# EAGLE schematic Comms_Cape (EAGLE 7.7.0)
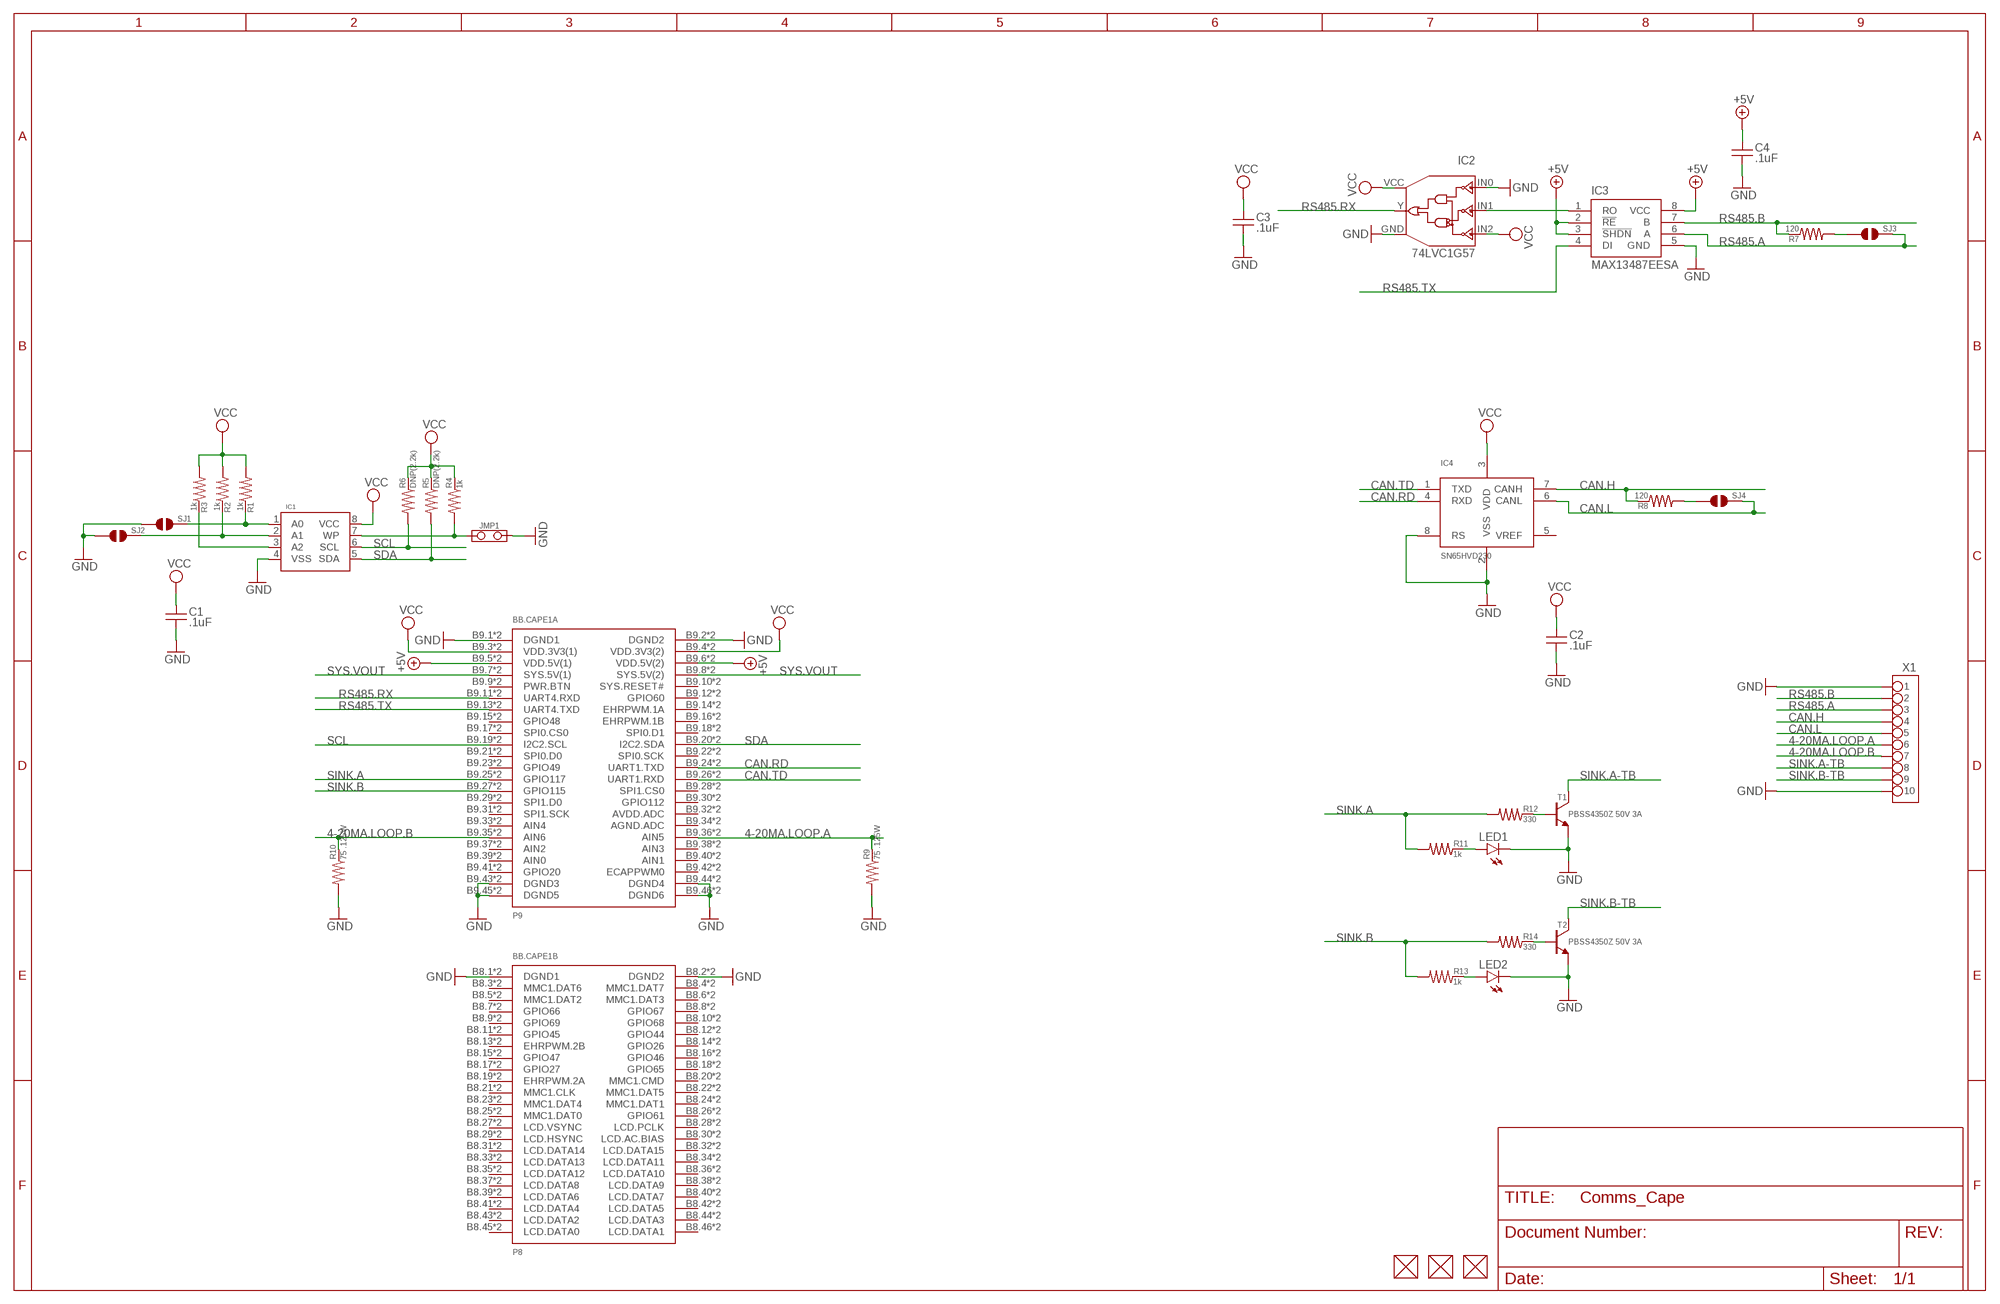
[diagram p0: schematic, sheet 1]

## Parts
BB.CAPE1  BEAGLEBONE.CAPE.TOP/BOTTOM-PADS  [BEAGLEBONE.CAPE.TOP/BOTTOM-PADS]
C1  .1uF  CAPACITOR-(INCH)-0402  [0402]
C2  .1uF  CAPACITOR-(INCH)-0402  [0402]
C3  .1uF  CAPACITOR-(INCH)-0402  [0402]
C4  .1uF  CAPACITOR-(INCH)-0402  [0402]
FUD1  FIDUCIAL  [FIDUCIAL_40MIL]
FUD2  FIDUCIAL  [FIDUCIAL_40MIL]
FUD3  FIDUCIAL  [FIDUCIAL_40MIL]
IC1  CAT24C32  [UDFN8,2X3(ON-SEMI)]
IC2  74LVC1G57  1G57-SOT-23-6  [SOT-23-6]
IC3  MAX13487EESA  [SOIC8]
IC4  SN65HVD230  MCP2551  [SO8]
JMP1  JUMPER-(X2)  [JUMPER-(X2)]
LED1  LED-(INCH)-0805  [0805-LED]
LED2  LED-(INCH)-0805  [0805-LED]
R1  1k  RESISTOR-(INCH)-0402  [0402]
R2  1k  RESISTOR-(INCH)-0402  [0402]
R3  1k  RESISTOR-(INCH)-0402  [0402]
R4  1k  RESISTOR-(INCH)-0402  [0402]
R5  DNP(2.2k)  RESISTOR-(INCH)-0402  [0402]
R6  DNP(2.2k)  RESISTOR-(INCH)-0402  [0402]
R7  120  RESISTOR-(INCH)-0402  [0402]
R8  120  RESISTOR-(INCH)-0402  [0402]
R9  75 .125W  RESISTOR-(INCH)-0805  [0805]
R10  75 .125W  RESISTOR-(INCH)-0805  [0805]
R11  1k  RESISTOR-(INCH)-0402  [0402]
R12  330  RESISTOR-(INCH)-0402  [0402]
R13  1k  RESISTOR-(INCH)-0402  [0402]
R14  330  RESISTOR-(INCH)-0402  [0402]
SJ1  SOLDER.JOINT-(INCH)-0402  [SOLDER.JOINT(0402)]
SJ2  SOLDER.JOINT-(INCH)-0402  [SOLDER.JOINT(0402)]
SJ3  SOLDER.JOINT-(INCH)-0402  [SOLDER.JOINT(0402)]
SJ4  SOLDER.JOINT-(INCH)-0402  [SOLDER.JOINT(0402)]
T1  PBSS4350Z 50V 3A  PBSS4350Z  [SOT223]
T2  PBSS4350Z 50V 3A  PBSS4350Z  [SOT223]
X1  TB-10TERM-150MIL.PITCH  [TERMINAL.BLOCK-10TERM-150MIL.PITCH]

## Nets
4-20MA.LOOP.A: BB.CAPE1.B9.36(A:AIN5) BB.CAPE1.T9.36(A:AIN5) R9.2 X1.6
4-20MA.LOOP.B: BB.CAPE1.B9.35(A:AIN6) BB.CAPE1.T9.35(A:AIN6) R10.2 X1.7
+5V [power]: BB.CAPE1.B9.5(A:VDD.5V(1)) BB.CAPE1.B9.6(A:VDD.5V(2)) BB.CAPE1.T9.5(A:VDD.5V(1)) BB.CAPE1.T9.6(A:VDD.5V(2)) C4.1 IC3.2(!RE) IC3.3(!SHDN) IC3.8(VCC)
A0: IC1.1(A0) R1.2 SJ1.2
A1: IC1.2(A1) R2.2 SJ2.2
A2: IC1.3(A2) R3.2
CAN.H: IC4.7(CANH) R8.2 X1.4
CAN.L: IC4.6(CANL) SJ4.2 X1.5
CAN.RD: BB.CAPE1.B9.24(A:UART1.TXD) BB.CAPE1.T9.24(A:UART1.TXD) IC4.4(RXD)
CAN.TD: BB.CAPE1.B9.26(A:UART1.RXD) BB.CAPE1.T9.26(A:UART1.RXD) IC4.1(TXD)
GND: BB.CAPE1.B8.1(B:DGND1) BB.CAPE1.B8.2(B:DGND2) BB.CAPE1.B9.1(A:DGND1) BB.CAPE1.B9.2(A:DGND2) BB.CAPE1.B9.43(A:DGND3) BB.CAPE1.B9.44(A:DGND4) BB.CAPE1.B9.45(A:DGND5) BB.CAPE1.B9.46(A:DGND6) BB.CAPE1.T8.1(B:DGND1) BB.CAPE1.T8.2(B:DGND2) BB.CAPE1.T9.1(A:DGND1) BB.CAPE1.T9.2(A:DGND2) BB.CAPE1.T9.43(A:DGND3) BB.CAPE1.T9.44(A:DGND4) BB.CAPE1.T9.45(A:DGND5) BB.CAPE1.T9.46(A:DGND6) C1.2 C2.2 C3.2 C4.2 IC1.4(VSS) IC2.GND IC2.IN0 IC3.5(GND) IC4.2(VSS) IC4.8(RS) JMP1.2 LED1.K LED2.K R9.1 R10.1 SJ1.1 SJ2.1 T1.3(E) T2.3(E) X1.1 X1.10
N$4: R8.1 SJ4.1
N$5: R7.1 SJ3.1
N$7: LED1.A R11.2
N$8: LED2.A R13.2
RS485.A: IC3.6(A) SJ3.2 X1.3
RS485.B: IC3.7(B) R7.2 X1.2
RS485.RX: BB.CAPE1.B9.11(A:UART4.RXD) BB.CAPE1.T9.11(A:UART4.RXD) IC2.Y
RS485.RX.5V: IC2.IN1 IC3.1(RO)
RS485.TX: BB.CAPE1.B9.13(A:UART4.TXD) BB.CAPE1.T9.13(A:UART4.TXD) IC3.4(DI)
SCL: BB.CAPE1.B9.19(A:I2C2.SCL) BB.CAPE1.T9.19(A:I2C2.SCL) IC1.6(SCL) R6.1
SDA: BB.CAPE1.B9.20(A:I2C2.SDA) BB.CAPE1.T9.20(A:I2C2.SDA) IC1.5(SDA) R5.1
SINK.A: BB.CAPE1.B9.25(A:GPIO117) BB.CAPE1.T9.25(A:GPIO117) R11.1 R12.1
SINK.A-BASE: R12.2 T1.1(B)
SINK.A-TB: T1.2(C) T1.4(C) X1.8
SINK.B: BB.CAPE1.B9.27(A:GPIO115) BB.CAPE1.T9.27(A:GPIO115) R13.1 R14.1
SINK.B-BASE: R14.2 T2.1(B)
SINK.B-TB: T2.2(C) T2.4(C) X1.9
SYS.VOUT: BB.CAPE1.B9.7(A:SYS.5V(1)) BB.CAPE1.B9.8(A:SYS.5V(2)) BB.CAPE1.T9.7(A:SYS.5V(1)) BB.CAPE1.T9.8(A:SYS.5V(2))
VCC: BB.CAPE1.B9.3(A:VDD.3V3(1)) BB.CAPE1.B9.4(A:VDD.3V3(2)) BB.CAPE1.T9.3(A:VDD.3V3(1)) BB.CAPE1.T9.4(A:VDD.3V3(2)) C1.1 C2.1 C3.1 IC1.8(VCC) IC2.IN2 IC2.VCC IC4.3(VDD) R1.1 R2.1 R3.1 R4.2 R5.2 R6.2
WP: IC1.7(WP) JMP1.1 R4.1
Unconnected: BB.CAPE1.B8.3(B:MMC1.DAT6) BB.CAPE1.B8.4(B:MMC1.DAT7) BB.CAPE1.B8.5(B:MMC1.DAT2) BB.CAPE1.B8.6(B:MMC1.DAT3) BB.CAPE1.B8.7(B:GPIO66) BB.CAPE1.B8.8(B:GPIO67) BB.CAPE1.B8.9(B:GPIO69) BB.CAPE1.B8.10(B:GPIO68) BB.CAPE1.B8.11(B:GPIO45) BB.CAPE1.B8.12(B:GPIO44) BB.CAPE1.B8.13(B:EHRPWM.2B) BB.CAPE1.B8.14(B:GPIO26) BB.CAPE1.B8.15(B:GPIO47) BB.CAPE1.B8.16(B:GPIO46) BB.CAPE1.B8.17(B:GPIO27) BB.CAPE1.B8.18(B:GPIO65) BB.CAPE1.B8.19(B:EHRPWM.2A) BB.CAPE1.B8.20(B:MMC1.CMD) BB.CAPE1.B8.21(B:MMC1.CLK) BB.CAPE1.B8.22(B:MMC1.DAT5) BB.CAPE1.B8.23(B:MMC1.DAT4) BB.CAPE1.B8.24(B:MMC1.DAT1) BB.CAPE1.B8.25(B:MMC1.DAT0) BB.CAPE1.B8.26(B:GPIO61) BB.CAPE1.B8.27(B:LCD.VSYNC) BB.CAPE1.B8.28(B:LCD.PCLK) BB.CAPE1.B8.29(B:LCD.HSYNC) BB.CAPE1.B8.30(B:LCD.AC.BIAS) BB.CAPE1.B8.31(B:LCD.DATA14) BB.CAPE1.B8.32(B:LCD.DATA15) BB.CAPE1.B8.33(B:LCD.DATA13) BB.CAPE1.B8.34(B:LCD.DATA11) BB.CAPE1.B8.35(B:LCD.DATA12) BB.CAPE1.B8.36(B:LCD.DATA10) BB.CAPE1.B8.37(B:LCD.DATA8) BB.CAPE1.B8.38(B:LCD.DATA9) BB.CAPE1.B8.39(B:LCD.DATA6) BB.CAPE1.B8.40(B:LCD.DATA7) BB.CAPE1.B8.41(B:LCD.DATA4) BB.CAPE1.B8.42(B:LCD.DATA5) BB.CAPE1.B8.43(B:LCD.DATA2) BB.CAPE1.B8.44(B:LCD.DATA3) BB.CAPE1.B8.45(B:LCD.DATA0) BB.CAPE1.B8.46(B:LCD.DATA1) BB.CAPE1.B9.9(A:PWR.BTN) BB.CAPE1.B9.10(A:SYS.RESET#) BB.CAPE1.B9.12(A:GPIO60) BB.CAPE1.B9.14(A:EHRPWM.1A) BB.CAPE1.B9.15(A:GPIO48) BB.CAPE1.B9.16(A:EHRPWM.1B) BB.CAPE1.B9.17(A:SPI0.CS0) BB.CAPE1.B9.18(A:SPI0.D1) BB.CAPE1.B9.21(A:SPI0.D0) BB.CAPE1.B9.22(A:SPI0.SCK) BB.CAPE1.B9.23(A:GPIO49) BB.CAPE1.B9.28(A:SPI1.CS0) BB.CAPE1.B9.29(A:SPI1.D0) BB.CAPE1.B9.30(A:GPIO112) BB.CAPE1.B9.31(A:SPI1.SCK) BB.CAPE1.B9.32(A:AVDD.ADC) BB.CAPE1.B9.33(A:AIN4) BB.CAPE1.B9.34(A:AGND.ADC) BB.CAPE1.B9.37(A:AIN2) BB.CAPE1.B9.38(A:AIN3) BB.CAPE1.B9.39(A:AIN0) BB.CAPE1.B9.40(A:AIN1) BB.CAPE1.B9.41(A:GPIO20) BB.CAPE1.B9.42(A:ECAPPWM0) BB.CAPE1.T8.3(B:MMC1.DAT6) BB.CAPE1.T8.4(B:MMC1.DAT7) BB.CAPE1.T8.5(B:MMC1.DAT2) BB.CAPE1.T8.6(B:MMC1.DAT3) BB.CAPE1.T8.7(B:GPIO66) BB.CAPE1.T8.8(B:GPIO67) BB.CAPE1.T8.9(B:GPIO69) BB.CAPE1.T8.10(B:GPIO68) BB.CAPE1.T8.11(B:GPIO45) BB.CAPE1.T8.12(B:GPIO44) BB.CAPE1.T8.13(B:EHRPWM.2B) BB.CAPE1.T8.14(B:GPIO26) BB.CAPE1.T8.15(B:GPIO47) BB.CAPE1.T8.16(B:GPIO46) BB.CAPE1.T8.17(B:GPIO27) BB.CAPE1.T8.18(B:GPIO65) BB.CAPE1.T8.19(B:EHRPWM.2A) BB.CAPE1.T8.20(B:MMC1.CMD) BB.CAPE1.T8.21(B:MMC1.CLK) BB.CAPE1.T8.22(B:MMC1.DAT5) BB.CAPE1.T8.23(B:MMC1.DAT4) BB.CAPE1.T8.24(B:MMC1.DAT1) BB.CAPE1.T8.25(B:MMC1.DAT0) BB.CAPE1.T8.26(B:GPIO61) BB.CAPE1.T8.27(B:LCD.VSYNC) BB.CAPE1.T8.28(B:LCD.PCLK) BB.CAPE1.T8.29(B:LCD.HSYNC) BB.CAPE1.T8.30(B:LCD.AC.BIAS) BB.CAPE1.T8.31(B:LCD.DATA14) BB.CAPE1.T8.32(B:LCD.DATA15) BB.CAPE1.T8.33(B:LCD.DATA13) BB.CAPE1.T8.34(B:LCD.DATA11) BB.CAPE1.T8.35(B:LCD.DATA12) BB.CAPE1.T8.36(B:LCD.DATA10) BB.CAPE1.T8.37(B:LCD.DATA8) BB.CAPE1.T8.38(B:LCD.DATA9) BB.CAPE1.T8.39(B:LCD.DATA6) BB.CAPE1.T8.40(B:LCD.DATA7) BB.CAPE1.T8.41(B:LCD.DATA4) BB.CAPE1.T8.42(B:LCD.DATA5) BB.CAPE1.T8.43(B:LCD.DATA2) BB.CAPE1.T8.44(B:LCD.DATA3) BB.CAPE1.T8.45(B:LCD.DATA0) BB.CAPE1.T8.46(B:LCD.DATA1) BB.CAPE1.T9.9(A:PWR.BTN) BB.CAPE1.T9.10(A:SYS.RESET#) BB.CAPE1.T9.12(A:GPIO60) BB.CAPE1.T9.14(A:EHRPWM.1A) BB.CAPE1.T9.15(A:GPIO48) BB.CAPE1.T9.16(A:EHRPWM.1B) BB.CAPE1.T9.17(A:SPI0.CS0) BB.CAPE1.T9.18(A:SPI0.D1) BB.CAPE1.T9.21(A:SPI0.D0) BB.CAPE1.T9.22(A:SPI0.SCK) BB.CAPE1.T9.23(A:GPIO49) BB.CAPE1.T9.28(A:SPI1.CS0) BB.CAPE1.T9.29(A:SPI1.D0) BB.CAPE1.T9.30(A:GPIO112) BB.CAPE1.T9.31(A:SPI1.SCK) BB.CAPE1.T9.32(A:AVDD.ADC) BB.CAPE1.T9.33(A:AIN4) BB.CAPE1.T9.34(A:AGND.ADC) BB.CAPE1.T9.37(A:AIN2) BB.CAPE1.T9.38(A:AIN3) BB.CAPE1.T9.39(A:AIN0) BB.CAPE1.T9.40(A:AIN1) BB.CAPE1.T9.41(A:GPIO20) BB.CAPE1.T9.42(A:ECAPPWM0) FUD1.P$1 FUD2.P$1 FUD3.P$1 IC4.5(VREF)

## Library data of the parts
BB.CAPE1 = GHI-Solutions:BEAGLEBONE.CAPE.
C1-C4 = GHI-BasicComponents:CAPACITOR-(INCH)-: Basic SMD ceramic capacitors
FUD1-FUD3 = GHI:FIDUCIAL
IC1 = GHI-IC:CAT24C32: 32-Kb I2C CMOS Serial EEPROM
IC2 = GHI2:1G57-SOT-23-6: A Multi-Functional Logic Gate: AND, OR, Inverter
IC3 = GHI3:MAX13487EESA
IC4 = GHI:MCP2551
JMP1 = GHI-Headers:JUMPER-(X2)
LED1 LED2 = GHI-BasicComponents:LED-(INCH)-: Basic SMD LEDs
R1-R14 = GHI-BasicComponents:RESISTOR-(INCH)-: Basic SMD Resistors
SJ1-SJ4 = GHI-Miscellaneous:SOLDER.JOINT-(INCH)-: Solder Joint (Bridge) Pads - For easy solder joining.
T1 T2 = GHI-Transistors:PBSS4350Z
X1 = GHI-Connectors:TB-10TERM-150MIL.PITCH